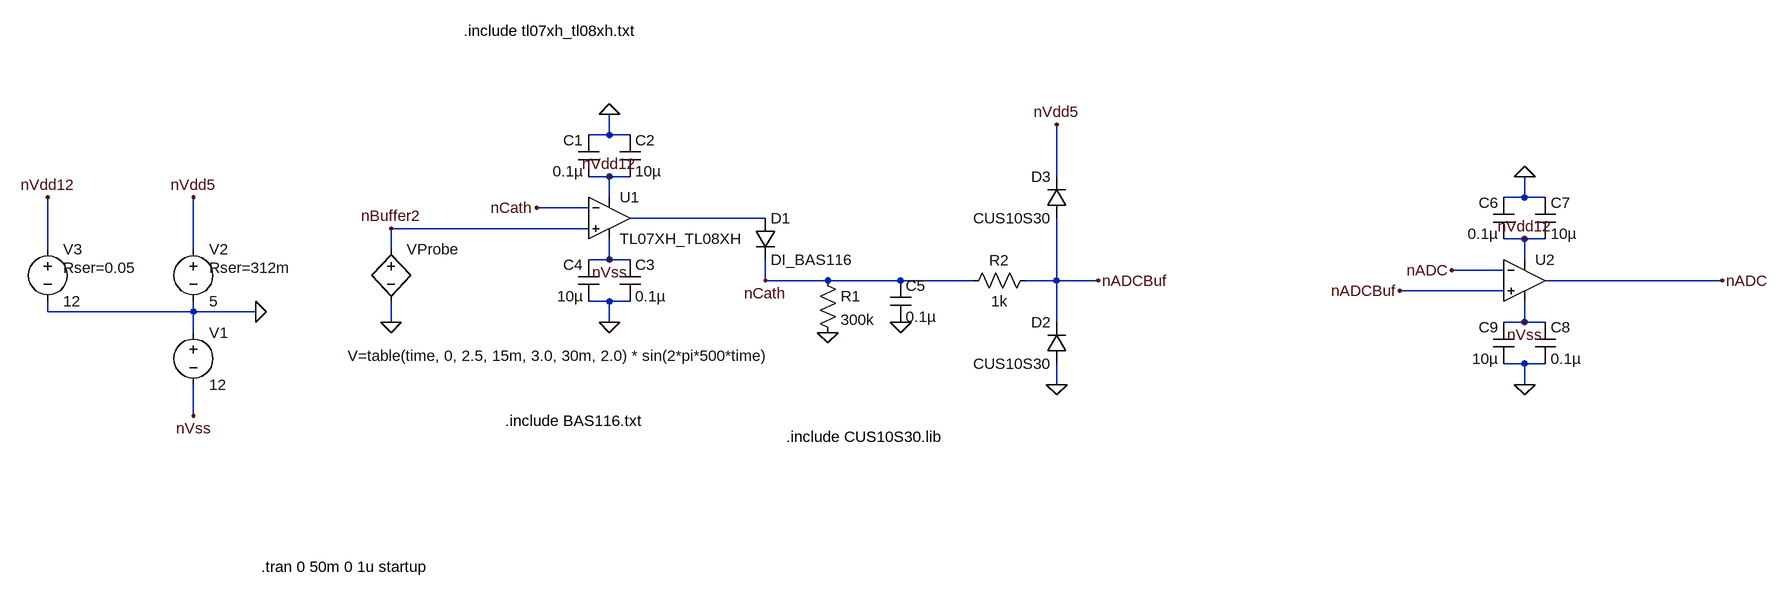
[diagram p0: schematic Stage5SuperPeakDetector_Buffer.asc]
Stage5SuperPeakDetector_Buffer.asc, the LTspice schematic file:
Version 4
SHEET 1 2664 680
WIRE 800 -208 800 -240
WIRE 800 -208 768 -208
WIRE 832 -208 800 -208
WIRE 800 -144 768 -144
WIRE 832 -144 800 -144
WIRE 1488 -144 1488 -224
WIRE 800 -112 800 -144
WIRE 2208 -112 2208 -144
WIRE 2208 -112 2176 -112
WIRE 2240 -112 2208 -112
WIRE 768 -96 688 -96
WIRE 1040 -80 832 -80
WIRE 768 -64 464 -64
WIRE 2208 -48 2176 -48
WIRE 2240 -48 2208 -48
WIRE -64 -32 -64 -112
WIRE 160 -32 160 -112
WIRE 464 -32 464 -64
WIRE 800 -16 800 -48
WIRE 800 -16 768 -16
WIRE 832 -16 800 -16
WIRE 2208 -16 2208 -48
WIRE 2176 0 2096 0
WIRE 1040 16 1040 -16
WIRE 1136 16 1040 16
WIRE 1248 16 1136 16
WIRE 1360 16 1248 16
WIRE 1488 16 1488 -80
WIRE 1488 16 1440 16
WIRE 1552 16 1488 16
WIRE 2512 16 2240 16
WIRE 2176 32 2016 32
WIRE 800 48 768 48
WIRE 832 48 800 48
WIRE -64 64 -64 48
WIRE 160 64 160 48
WIRE 160 64 -64 64
WIRE 256 64 160 64
WIRE 464 80 464 48
WIRE 800 80 800 48
WIRE 1488 80 1488 16
WIRE 2208 80 2208 48
WIRE 2208 80 2176 80
WIRE 2240 80 2208 80
WIRE 160 96 160 64
WIRE 2208 144 2176 144
WIRE 2240 144 2208 144
WIRE 1488 176 1488 144
WIRE 2208 176 2208 144
WIRE 160 224 160 176
FLAG 256 64 0
FLAG 160 224 nVss
FLAG 160 -112 nVdd5
FLAG -64 -112 nVdd12
FLAG 800 -144 nVdd12
FLAG 800 -16 nVss
FLAG 688 -96 nCath
FLAG 464 -64 nBuffer2
FLAG 1040 16 nCath
FLAG 1248 80 0
FLAG 1136 96 0
FLAG 1488 176 0
FLAG 1488 -224 nVdd5
FLAG 1552 16 nADCBuf
FLAG 800 -240 0
FLAG 800 80 0
FLAG 2208 -48 nVdd12
FLAG 2208 80 nVss
FLAG 2016 32 nADCBuf
FLAG 2096 0 nADC
FLAG 2512 16 nADC
FLAG 2208 -144 0
FLAG 2208 176 0
FLAG 464 80 0
SYMBOL voltage 160 80 R0
WINDOW 123 0 0 Left 0
WINDOW 39 0 0 Left 0
SYMATTR InstName V1
SYMATTR Value 12
SYMBOL voltage 160 -48 R0
WINDOW 123 0 0 Left 0
WINDOW 39 24 44 Left 2
SYMATTR SpiceLine Rser=312m
SYMATTR InstName V2
SYMATTR Value 5
SYMBOL voltage -64 -48 R0
WINDOW 123 0 0 Left 0
WINDOW 39 24 44 Left 2
SYMATTR SpiceLine Rser=0.05
SYMATTR InstName V3
SYMATTR Value 12
SYMBOL res 1120 0 R0
SYMATTR InstName R1
SYMATTR Value 300k
SYMATTR SpiceLine tol=1 pwr=0.25
SYMBOL res 1456 0 R90
WINDOW 0 0 56 VBottom 2
WINDOW 3 32 56 VTop 2
SYMATTR InstName R2
SYMATTR Value 1k
SYMATTR SpiceLine tol=1 pwr=0.25
SYMBOL OpAmps\\opamp2 800 -144 R0
SYMATTR InstName U1
SYMATTR Value TL07XH_TL08XH
SYMBOL cap 784 -144 R180
WINDOW 0 24 56 Left 2
WINDOW 3 24 8 Left 2
SYMATTR InstName C1
SYMATTR Value 0.1µ
SYMATTR SpiceLine V=16 Irms=0.6 Rser=0.05
SYMBOL cap 816 -208 R0
SYMATTR InstName C2
SYMATTR Value 10µ
SYMATTR SpiceLine V=10 Irms=1.25 Rser=5m
SYMBOL cap 816 -16 R0
SYMATTR InstName C3
SYMATTR Value 0.1µ
SYMATTR SpiceLine V=16 Irms=0.6 Rser=0.05
SYMBOL cap 784 48 R180
WINDOW 0 24 56 Left 2
WINDOW 3 24 8 Left 2
SYMATTR InstName C4
SYMATTR Value 10µ
SYMATTR SpiceLine V=10 Irms=1.25 Rser=5m
SYMBOL diode 1024 -80 R0
SYMATTR InstName D1
SYMATTR Value DI_BAS116
SYMBOL diode 1504 144 R180
WINDOW 0 24 64 Left 2
WINDOW 3 24 0 Left 2
SYMATTR InstName D2
SYMATTR Value CUS10S30
SYMATTR Prefix X
SYMBOL cap 1232 16 R0
SYMATTR InstName C5
SYMATTR Value 0.1µ
SYMATTR SpiceLine V=16 Irms=0.6 Rser=0.05
SYMBOL diode 1504 -80 R180
WINDOW 0 24 64 Left 2
WINDOW 3 24 0 Left 2
SYMATTR InstName D3
SYMATTR Value CUS10S30
SYMATTR Prefix X
SYMBOL cap 2192 -48 R180
WINDOW 0 24 56 Left 2
WINDOW 3 24 8 Left 2
SYMATTR InstName C6
SYMATTR Value 0.1µ
SYMATTR SpiceLine V=16 Irms=0.6 Rser=0.05
SYMBOL cap 2224 -112 R0
SYMATTR InstName C7
SYMATTR Value 10µ
SYMATTR SpiceLine V=10 Irms=1.25 Rser=5m
SYMBOL cap 2224 80 R0
SYMATTR InstName C8
SYMATTR Value 0.1µ
SYMATTR SpiceLine V=16 Irms=0.6 Rser=0.05
SYMBOL cap 2192 144 R180
WINDOW 0 24 56 Left 2
WINDOW 3 24 8 Left 2
SYMATTR InstName C9
SYMATTR Value 10µ
SYMATTR SpiceLine V=10 Irms=1.25 Rser=5m
SYMBOL OpAmps\\UniversalOpAmp2 2208 16 R0
SYMATTR InstName U2
SYMBOL bv 464 -48 R0
WINDOW 3 -67 180 Left 2
SYMATTR InstName VProbe
SYMATTR Value V=table(time, 0, 2.5, 15m, 3.0, 30m, 2.0) * sin(2*pi*500*time)
TEXT 264 456 Left 2 !.tran 0 50m 0 1u startup
TEXT 640 232 Left 2 !.include BAS116.txt
TEXT 1072 256 Left 2 !.include CUS10S30.lib
TEXT 576 -368 Left 2 !.include tl07xh_tl08xh.txt

The netlist it stands for:
* Stage5SuperPeakDetector_Buffer.asc
V1 0 nVss 12
V2 nVdd5 0 5 Rser=312m
V3 nVdd12 0 12 Rser=0.05
R1 nCath 0 300k tol=1 pwr=0.25
R2 nADCBuf nCath 1k tol=1 pwr=0.25
XU1 nBuffer2 nCath nVdd12 nVss N001 TL07XH_TL08XH  ; pins In+ In- V+ V- OUT
C1 nVdd12 0 0.1µ V=16 Irms=0.6 Rser=0.05
C2 0 nVdd12 10µ V=10 Irms=1.25 Rser=5m
C3 nVss 0 0.1µ V=16 Irms=0.6 Rser=0.05
C4 0 nVss 10µ V=10 Irms=1.25 Rser=5m
D1 N001 nCath DI_BAS116
XD2 0 nADCBuf CUS10S30  ; pins + -
C5 nCath 0 0.1µ V=16 Irms=0.6 Rser=0.05
XD3 nADCBuf nVdd5 CUS10S30  ; pins + -
C6 nVdd12 0 0.1µ V=16 Irms=0.6 Rser=0.05
C7 0 nVdd12 10µ V=10 Irms=1.25 Rser=5m
C8 nVss 0 0.1µ V=16 Irms=0.6 Rser=0.05
C9 0 nVss 10µ V=10 Irms=1.25 Rser=5m
XU2 nADCBuf nADC nVdd12 nVss nADC level2 Avol=1Meg GBW=10Meg Slew=10Meg Ilimit=25m Rail=0 Vos=0 En=0 Enk=0 In=0 Ink=0 Rin=500Meg  ; pins In+ In- V+ V- OUT
B§VProbe nBuffer2 0 V=table(time, 0, 2.5, 15m, 3.0, 30m, 2.0) * sin(2*pi*500*time)
.model D D
.lib standard.dio
.tran 0 50m 0 1u startup
.include BAS116.txt
.include CUS10S30.lib
.include tl07xh_tl08xh.txt
.lib UniversalOpAmp2.lib
.backanno
.end